# Altium schematic sheet Structure_sheet.SchDoc
size 420 x 297 mm; Address1: Address1; Address2: Address2; Address3: Address3; Address4: Address4; DocumentNumber: АБВГ.123456.001 Э3; SheetNumber: 1; Scale: 1:1; DocumentType: Схема электрическая принципиальная; FirstReferrence: АБВГ.123456.001
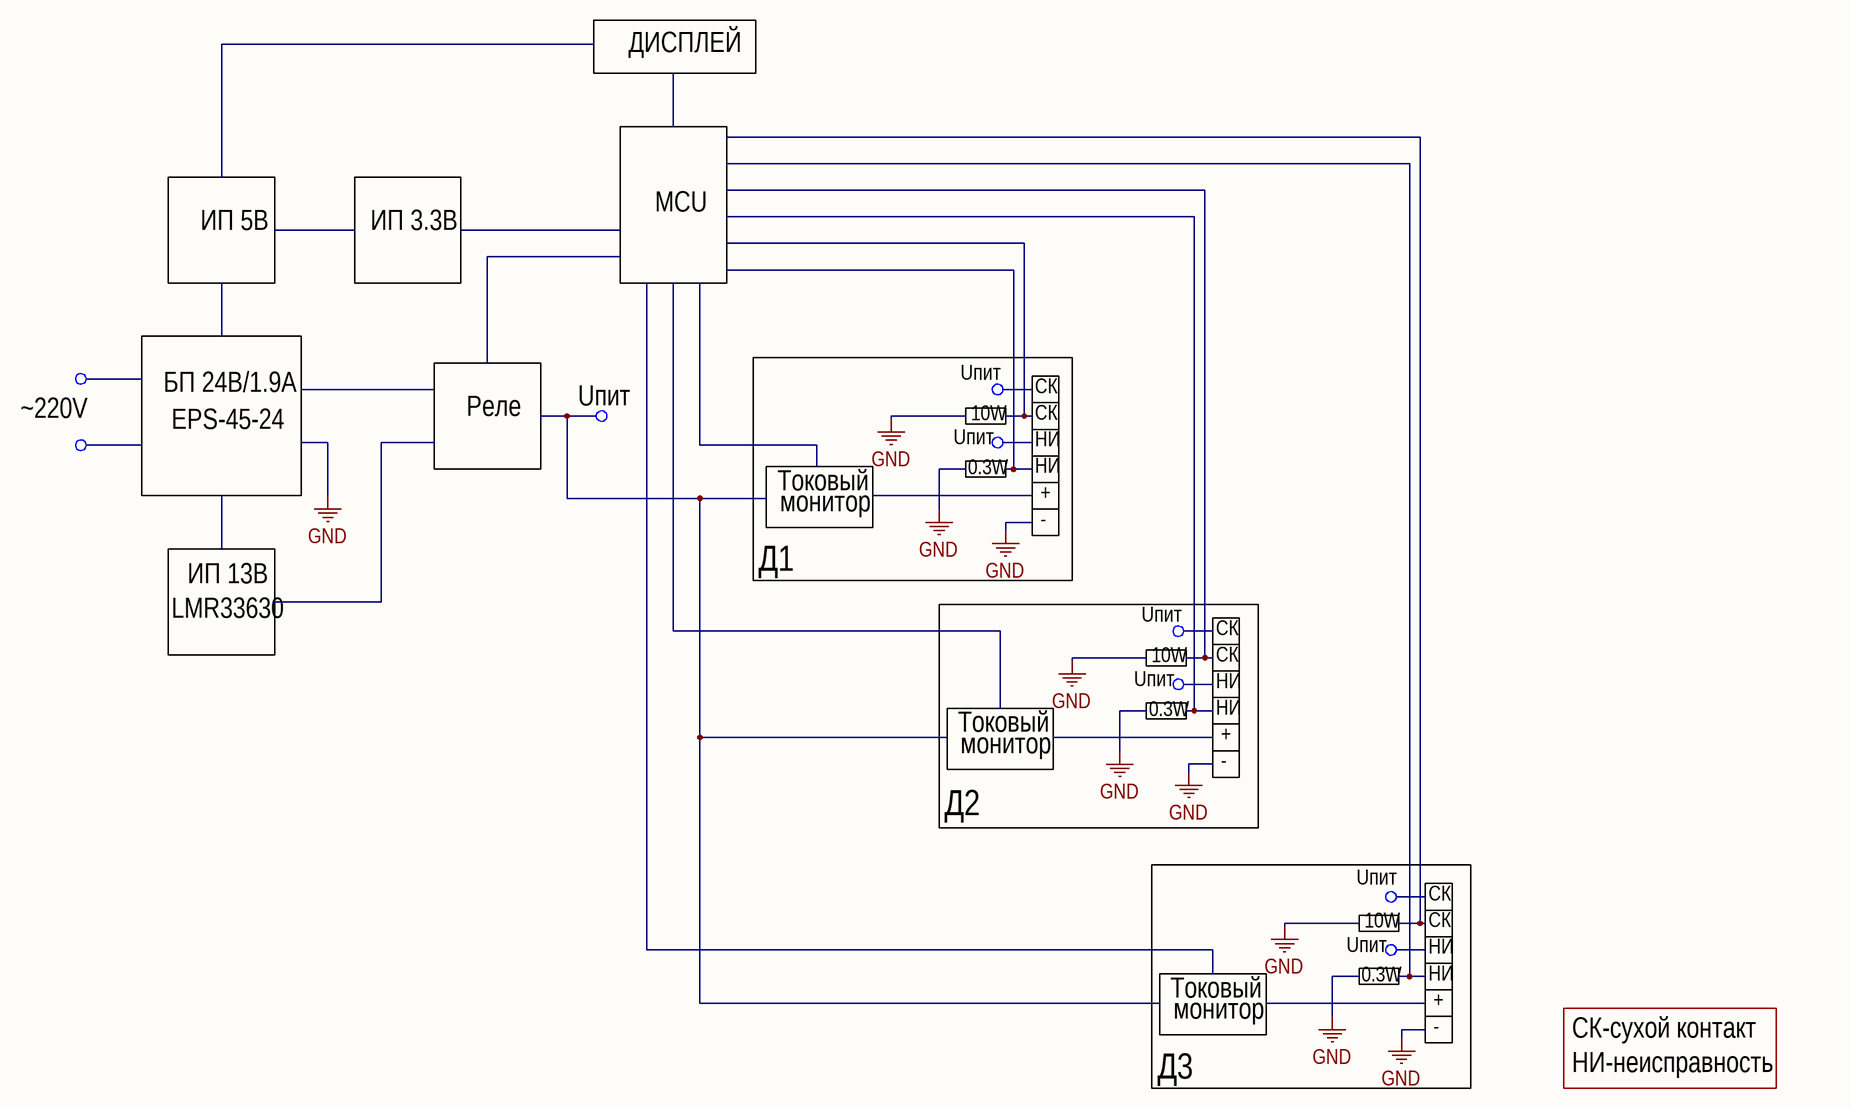
[diagram p0: Structure_sheet.SchDoc]

## Notes on the sheet
- ДИСПЛЕЙ
- MCU
- ИП 5В
- ИП 3.3В
- ~220V
- БП 24В/1.9А
- Реле
- Uпит
- 10W
- СК
- EPS-45-24
- Токовый
- 0.3W
- НИ
- монитор
- +
- -
- LMR33630
- ИП 13В
- Д1
- Д2
- Д3
- НИ-неисправность
- СК-сухой контакт
- Перв. примен.
- Справ. №
- Подп. и дата
- Инв. № дубл.
- Взам. инв. №
- Разраб.
- Изм.
- Лист
- № докум.
- Подп.
- Дата
- Лит.
- Масса
- Масштаб
- Пров.
- Т.контр.
- Листов
- Инв. № подл.
- Утв.
- Н.контр.
- 2.106-A3
- Копировал
- Формат А3